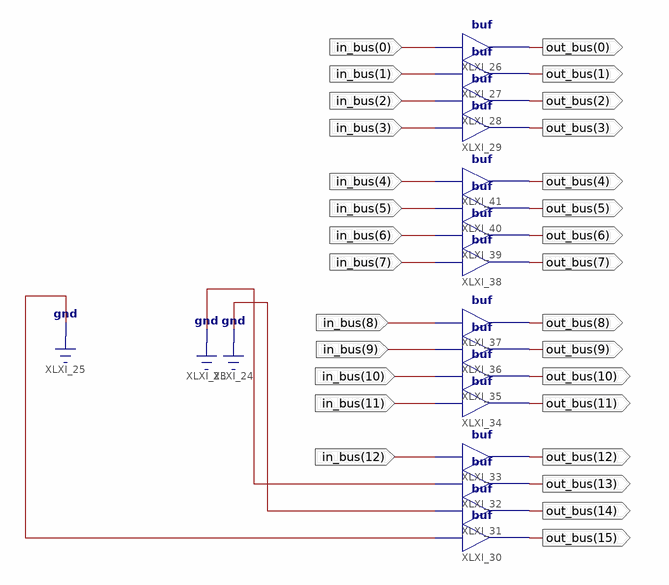
[diagram p0: schematic sheet 1]
// Xilinx ISE schematic buf161.sch (spartan6) as structural Verilog: 16 symbols, 29 ports
module buf161 (
  input  [12:0] in_bus,
  output [15:0] out_bus
);

  buf XLXI_26 (out_bus[0], in_bus[0]);
  buf XLXI_27 (out_bus[1], in_bus[1]);
  buf XLXI_28 (out_bus[2], in_bus[2]);
  buf XLXI_29 (out_bus[3], in_bus[3]);
  buf XLXI_30 (out_bus[15], 1'b0);
  buf XLXI_31 (out_bus[14], 1'b0);
  buf XLXI_32 (out_bus[13], 1'b0);
  buf XLXI_33 (out_bus[12], in_bus[12]);
  buf XLXI_34 (out_bus[11], in_bus[11]);
  buf XLXI_35 (out_bus[10], in_bus[10]);
  buf XLXI_36 (out_bus[9], in_bus[9]);
  buf XLXI_37 (out_bus[8], in_bus[8]);
  buf XLXI_38 (out_bus[7], in_bus[7]);
  buf XLXI_39 (out_bus[6], in_bus[6]);
  buf XLXI_40 (out_bus[5], in_bus[5]);
  buf XLXI_41 (out_bus[4], in_bus[4]);
endmodule
